# EAGLE design igniterPCB (EAGLE 7.2.0)
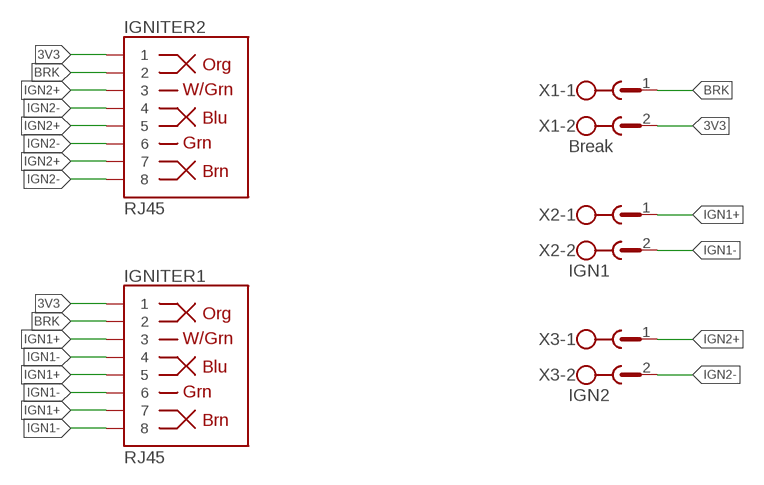
[diagram p0: schematic, sheet 1]

## Parts
IGNITER1  RJ45  RJ45-8PTH  [RJ45-8]
IGNITER2  RJ45  RJ45-8PTH  [RJ45-8]
X1  Break  MSTBA2  [MSTBA2]
X2  IGN1  MSTBA2  [MSTBA2]
X3  IGN2  MSTBA2  [MSTBA2]

## Nets
3V3: IGNITER1.1 IGNITER2.1 X1.2
BRK: IGNITER1.2 IGNITER2.2 X1.1
IGN1+: IGNITER1.3 IGNITER1.5 IGNITER1.7 X2.1
IGN1-: IGNITER1.4 IGNITER1.6 IGNITER1.8 X2.2
IGN2+: IGNITER2.3 IGNITER2.5 IGNITER2.7 X3.1
IGN2-: IGNITER2.4 IGNITER2.6 IGNITER2.8 X3.2

## Library data of the parts
IGNITER1 IGNITER2 = SparkFun-Connectors:RJ45-8: RJ45 Jack Simple RJ45, 8-pin connection - connector for common Cat5, Cat5e, and Cat6 Ethernet cables. Footprint not yet proven in production. Connector sku is PRT-00643; Breakout PCB sku is BOB-00716.; PROD_ID: CONN-08506
X1-X3 = con-phoenix-508:MSTBA2: PHOENIX; MF: FARNELL; MPN: 1757242; OC_FARNELL: 3705171; OC_NEWARK: 71C4161

## Board
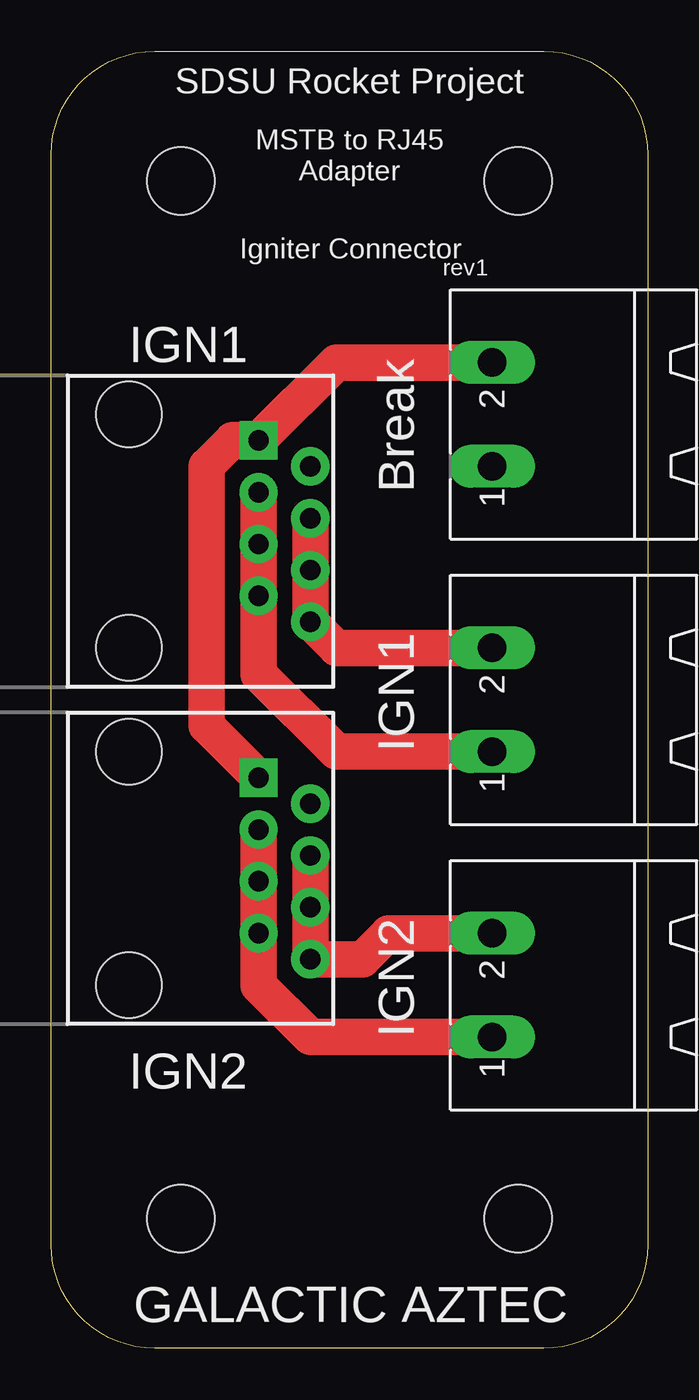
[diagram p1: board, top side]
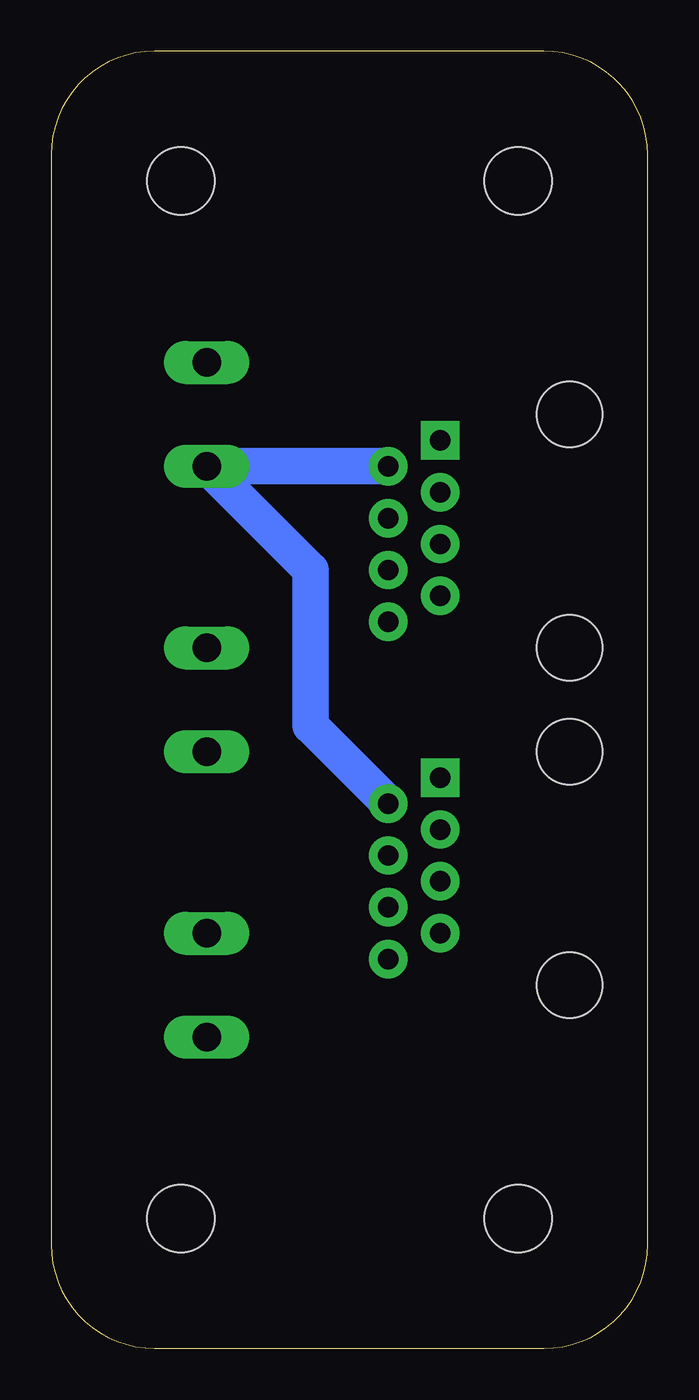
[diagram p2: board, bottom side, seen from below]

Size 29.21 x 63.5 mm. Coordinates in mm from the lower left corner, seen from the top.
Outline: 24.13,0 5.08,0 arc-90 0,5.08 0,58.42 arc-90 5.08,63.5 24.13,63.5 arc-90 29.21,58.42 29.21,5.08 arc-90 24.13,0
Copper layers (1*16): Top 0.0356mm / dielectric 1.5011mm / Bottom 0.0356mm
Design rules "SparkFunBestPractices": minimum track width 10mil, minimum drill 13mil, track to track 10mil, track to pad 10mil, pad to pad 10mil, via to via 10mil, smd to smd 10mil, copper to edge 15mil, drill to drill 12mil, minimum pad ring 7mil, minimum via ring 7mil, stop-mask expansion 3mil, vias tented up to drill 0mil, thermal gap 10mil

### Footprints (pad centres in the part's own frame; a part is rotated, then mirrored left to right if it is on the bottom)
RJ45-8 = drill 1 pad 1.88 square: 1 -4.445,6.35 | drill 1 pad 1.88: 2 -3.175,8.89; 3 -1.905,6.35; 4 -0.635,8.89; 5 0.635,6.35; 6 1.905,8.89; 7 3.175,6.35; 8 4.445,8.89 | hole 3.2: -5.715,0; 5.715,0
STAND-OFF = hole 3.302: 0,0
MSTBA2 = drill 1.397 long: 1 -2.54,5.08; 2 2.54,5.08

### Placement (x,y rotation side)
IGNITER1  3.81,40.01 270 top
IGNITER2  3.81,23.5 270 top
U$1  [STAND-OFF]  22.86,6.35 0 top
U$2  [STAND-OFF]  6.35,6.35 0 top
U$3  [STAND-OFF]  22.86,57.15 0 top
U$4  [STAND-OFF]  6.35,57.15 0 top
X1  26.67,45.72 90 top
X2  26.67,31.75 90 top
X3  26.67,17.78 90 top

### Tracks (layer width: path | path; a pad name or v marks a point on that pad's centre or on a via)
3V3
  Top 1.778: IGNITER2.1 7.62,30.48 7.62,43.18 8.89,44.45 IGNITER1.1 13.97,48.26 X1.2
BRK
  Bottom 1.778: IGNITER2.2 16.51,30.48 16.51,38.1 X1.1 IGNITER1.2
IGN1+
  Top 1.778: X2.1 13.97,29.21 10.16,33.02 IGNITER1.7 IGNITER1.5 IGNITER1.3
IGN1-
  Top 1.778: X2.2 13.97,34.29 IGNITER1.8 IGNITER1.6 IGNITER1.4
IGN2+
  Top 1.778: X3.1 12.7,15.24 10.16,17.78 IGNITER2.7 IGNITER2.5 IGNITER2.3
IGN2-
  Top 1.778: X3.2 16.51,20.32 15.24,19.05 IGNITER2.8 IGNITER2.6 IGNITER2.4

### Text on the board
tNames: SDSU Rocket Project | MSTB to RJ45 / Adapter | Igniter Connector | rev1 | IGN1 | IGN2 | GALACTIC AZTEC